# Altium project ERC QSTP_1.PrjPcb
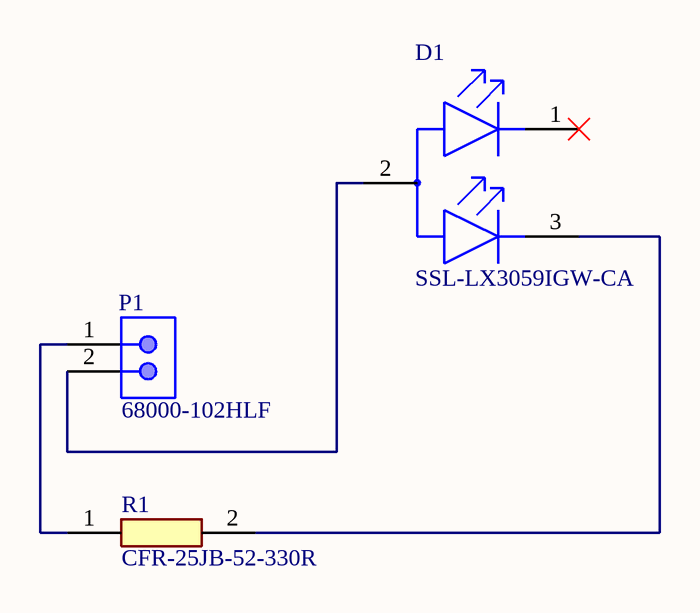
[diagram p0: Sheet1.SchDoc]
1 sheet, 3 parts. Net scope: global (net labels, ports and power ports of the same name join across sheets).
Board file: PCB1.PcbDoc

## Sheet Sheet1.SchDoc
size A4; SheetNumber: 1; SheetTotal: 1

### Parts
D1  SSL-LX3059IGW-CA  [FP-SSL-LX3059IGW-CA-MFG]
P1  68000-102HLF  [AMPH-68000-102HLF_V]
R1  CFR-25JB-52-330R  [RESAD1590W60L630D240]

### Nets
NetD1_2: D1.2(COMMON_ANODE) P1.2
NetD1_3: D1.3(GREEN_C) R1.2
NetP1_1: P1.1 R1.1

Not connected (* = marked no-connect by the designer): D1 1(RED_C)*

### Library data of the parts
D1 = CMP-57192-000011-1: T-3MM BI-COLOR LED 635NM RED/; Illumination Color: Green; Lens Style: Dome; Forward Voltage: 2.2V; Viewing Angle: 60°; Forward Current: 20mA; Luminous Intensity: 30mcd; Number of LEDs: 2; Packaging: Bulk; Package Quantity: 1000; Min Operating Temperature: -40°C; Color: Green; Mount: Through Hole; Wavelength: 635nm; Lead Free: Lead Free; RoHS Compliant: Yes; Max Operating Temperature: 85°C; Number of Pins: 3
P1 = CMP-2000-05666-1: Male Header, Pitch 2.54 mm, 1 x 2 Position, Height 8.38 mm, Tail Length 2.41 mm, RoHS, Bulk; Number of Positions: 2; Insulation Resistance: 5000MOhms; Voltage Rating: 1.5kV; Mounting Angle: Vertical; Pitch: 2.54mm; Brand: FCI; Current Rating: 3A; Mating Post Length: 5.84mm; Operating Temperature Range: -65Cto+125C; Product Category: Headers&WireHousings; Datasheet URL: https://datasheet.ciiva.com/5149/68000-274228-5149165.pdf; Number of Positions / Contacts: 2; Contact Gender: Pin(Male); Packaging: Bulk; Mounting Technology: ThroughHole; Product Type: Headers; Housing Material: Thermoplastic; Contact Material: PhosphorBronze; Contact Plating: Gold/GTX; Package Description: Male Header, Pitch 2.54 mm, 1 x 2 Position, Height 8.38 mm, Tail Length 2.41 mm; Package Reference: 68000-102HLF; Type: Unshrouded; Factory Pack Quantity: 100; Termination Style: ThroughHole; RoHS: Details; Series: 68000; Mounting Style: ThroughHole; Flammability Rating: UL94V-0; Number of Rows: 1; Manufacturer: FCI; Termination Post Length: 2.41mm; Manufacturer URL: http://www.amphenol.com/; Datasheet Version: Rev. F, 04/2006
R1 = CFR-25JB-52-330R: Resistor; Manufacturer_Name: Yageo Group; Datasheet Link: https://www.yageo.com/upload/media/product/productsearch/datasheet/lr/YAGEO%20CFR_datasheet_2021v0.pdf; Manufacturer_Part_Number: CFR-25JB-52-330R; Mouser Part Number: 603-CFR-25JB-52-330R; Mouser Price/Stock: https://www.mouser.co.uk/ProductDetail/YAGEO/CFR-25JB-52-330R?qs=oypCK0zG327zv8pBwGe%252BbQ%3D%3D